# Altium project CoffeeScale.PrjPcb
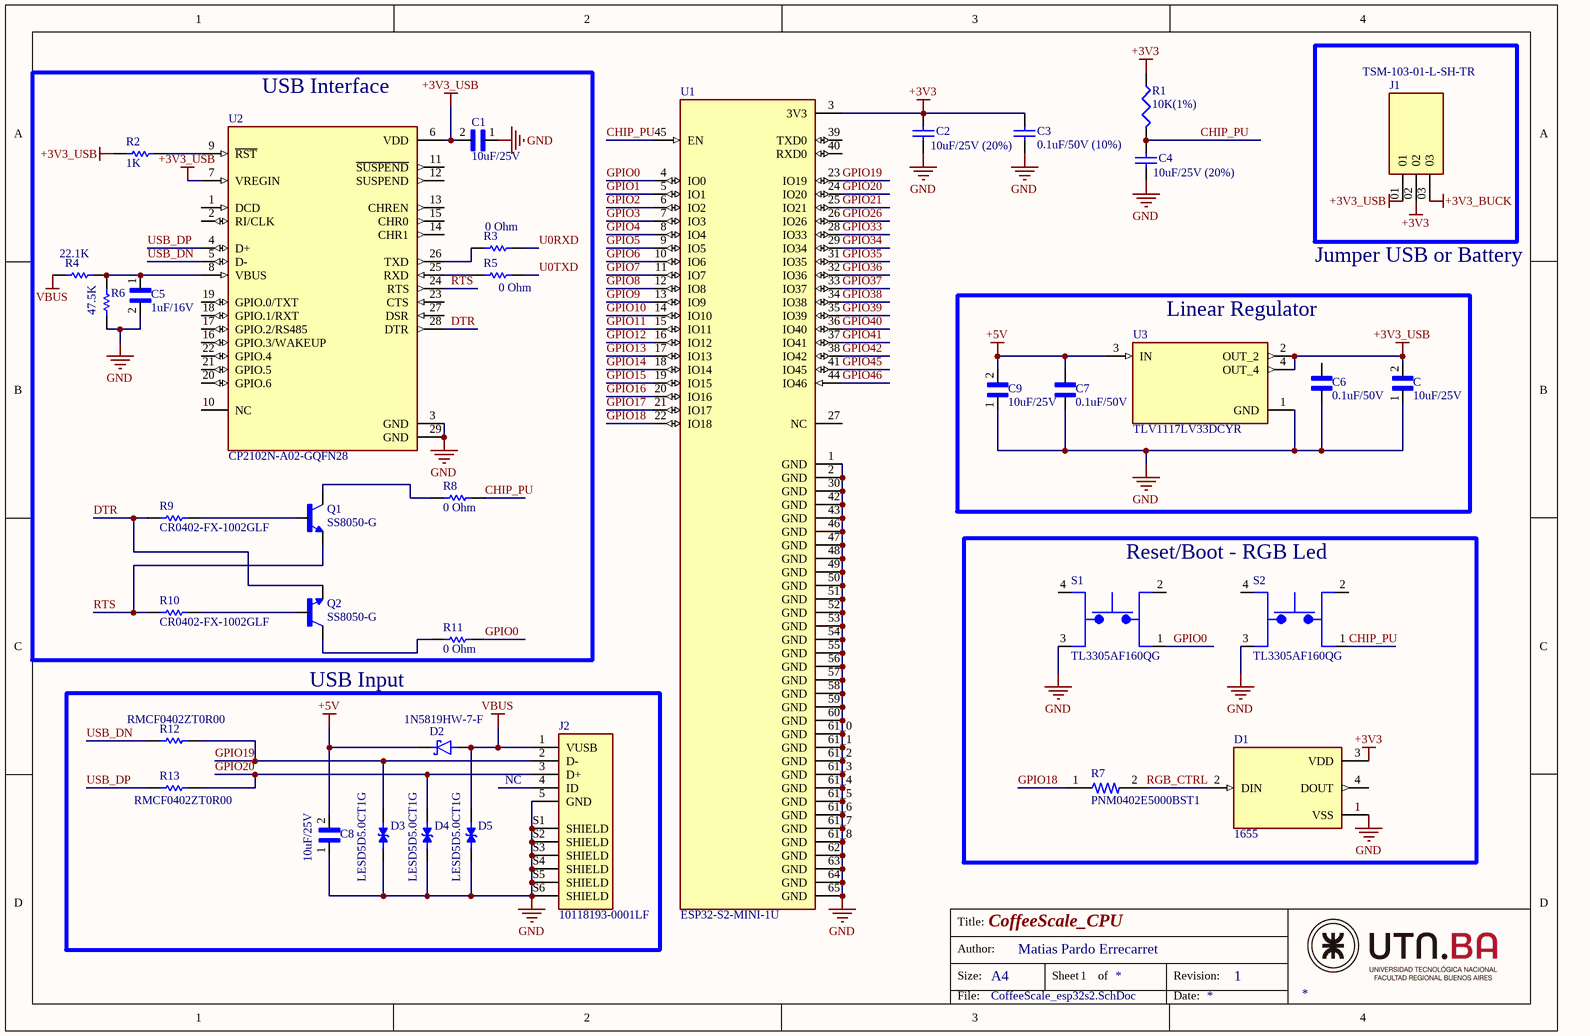
[diagram p0: CoffeeScale_esp32s2.SchDoc]
1 sheet, 37 parts. Net scope: global (net labels, ports and power ports of the same name join across sheets).

## Sheet CoffeeScale_esp32s2.SchDoc: CoffeeScale_CPU
size A4; Author: Matias Pardo Errecarret; Revision: 1; SheetNumber: 1

### Parts
C  10uF/25V  [CAPC2012X140N]
C1  10uF/25V  [CAPC2012X140N]
C2  10uF/25V (20%)  [RAD-0.3]
C3  0.1uF/50V (10%)  [RAD-0.3]
C4  10uF/25V (20%)  [RAD-0.3]
C5  1uF/16V  [CAPC1005X55N]
C6  0.1uF/50V  [CAPC1005X55N]
C7  0.1uF/50V  [CAPC1005X55N]
C8  10uF/25V  [CAPC2012X140N]
C9  10uF/25V  [CAPC2012X140N]
D1  1655  [LED_1655]
D2  1N5819HW-7-F  [SOD3715X145N]
D3  LESD5D5.0CT1G  [TVS_LESD5D5.0CT1G]
D4  LESD5D5.0CT1G  [TVS_LESD5D5.0CT1G]
D5  LESD5D5.0CT1G  [TVS_LESD5D5.0CT1G]
J1  TSM-103-01-L-SH-TR  [SAMTEC_TSM-103-01-L-SH-TR]
J2  10118193-0001LF  [AMPHENOL_10118193-0001LF]
Q1  SS8050-G  [TRANS_SS8050-G]
Q2  SS8050-G  [TRANS_SS8050-G]
R1  10K(1%)  [J1-0603]
R2  1K  [RESC1005X40N]
R3  0 Ohm  [RESC1005X40]
R4  22.1K  [RESC1005X40N]
R5  0 Ohm  [RESC1005X40]
R6  47.5K  [RESC1005X40N]
R7  PNM0402E5000BST1  [RESC1005X40]
R8  0 Ohm  [RESC1005X40]
R9  CR0402-FX-1002GLF  [RESC1005X40N]
R10  CR0402-FX-1002GLF  [RESC1005X40N]
R11  0 Ohm  [RESC1005X40]
R12  RMCF0402ZT0R00  [RESC1005X40]
R13  RMCF0402ZT0R00  [RESC1005X40]
S1  TL3305AF160QG  [SW_TL3305AF160QG]
S2  TL3305AF160QG  [SW_TL3305AF160QG]
U1  ESP32-S2-MINI-1U  [XCVR_ESP32-S2-MINI-1U]
U2  CP2102N-A02-GQFN28  [QFN50P500X500X80-29N]
U3  TLV1117LV33DCYR  [VREG_TLV1117LV33DCYR]

### Blocks framed on the sheet
USB Interface: C1 C5 Q1 Q2 R2-R6 R8-R11 U2
Linear Regulator: C C6 C7 C9 U3
Reset/Boot - RGB Led: D1 R7 S1 S2
USB Input: C8 D2-D5 J2 R12 R13

### Nets
+3V3: C2.2 C3.2 D1.3(VDD) J1.02 R1.1 U1.3(3V3)
+3V3_BUCK: J1.03
+3V3_USB: C.2 C1.2 J1.01 R2.1 U2.6(VDD) U2.7(VREGIN) U3.2(OUT_2) U3.4(OUT_4)
+5V: C7.2 C8.2 C9.2 D2.C(K) U3.3(IN)
GND: C.1 C1.1 C2.1 C3.1 C4.1 C5.2 C6.1 C7.1 C8.1 C9.1 D1.1(VSS) D3.1 D4.1 D5.1 J2.5(GND) J2.S1(SHIELD) J2.S2(SHIELD) J2.S3(SHIELD) J2.S4(SHIELD) J2.S5(SHIELD) J2.S6(SHIELD) R6.1 S1.3 S2.3 U1.1(GND) U1.2(GND) U1.30(GND) U1.42(GND) U1.43(GND) U1.46(GND) U1.47(GND) U1.48(GND) U1.49(GND) U1.50(GND) U1.51(GND) U1.52(GND) U1.53(GND) U1.54(GND) U1.55(GND) U1.56(GND) U1.57(GND) U1.58(GND) U1.59(GND) U1.60(GND) U1.61_0(GND) U1.61_1(GND) U1.61_2(GND) U1.61_3(GND) U1.61_4(GND) U1.61_5(GND) U1.61_6(GND) U1.61_7(GND) U1.61_8(GND) U1.62(GND) U1.63(GND) U1.64(GND) U1.65(GND) U2.3(GND) U2.29(GND) U3.1(GND)
VBUS: D2.A D5.2 J2.1(VUSB) R4.1
CHIP_PU: C4.2 R1.2 R8.2 S2.1 U1.45(EN)
DTR: Q2.2(E) R9.1 U2.28(DTR)
GPIO0: R11.2 S1.1 U1.4(IO0)
GPIO1: U1.5(IO1)
GPIO2: U1.6(IO2)
GPIO3: U1.7(IO3)
GPIO4: U1.8(IO4)
GPIO5: U1.9(IO5)
GPIO6: U1.10(IO6)
GPIO7: U1.11(IO7)
GPIO8: U1.12(IO8)
GPIO9: U1.13(IO9)
GPIO10: U1.14(IO10)
GPIO11: U1.15(IO11)
GPIO12: U1.16(IO12)
GPIO13: U1.17(IO13)
GPIO14: U1.18(IO14)
GPIO15: U1.19(IO15)
GPIO16: U1.20(IO16)
GPIO17: U1.21(IO17)
GPIO18: R7.1 U1.22(IO18)
GPIO19: D3.2 J2.2(D-) R12.2 U1.23(IO19)
GPIO20: D4.2 J2.3(D+) R13.2 U1.24(IO20)
GPIO21: U1.25(IO21)
GPIO26: U1.26(IO26)
GPIO33: U1.28(IO33)
GPIO34: U1.29(IO34)
GPIO35: U1.31(IO35)
GPIO36: U1.32(IO36)
GPIO37: U1.33(IO37)
GPIO38: U1.34(IO38)
GPIO39: U1.35(IO39)
GPIO40: U1.36(IO40)
GPIO41: U1.37(IO41)
GPIO42: U1.38(IO42)
GPIO45: U1.41(IO45)
GPIO46: U1.44(IO46)
RGB_CTRL: D1.2(DIN) R7.2
RTS: Q1.2(E) R10.1 U2.24(RTS)
U0RXD: R3.2
U0TXD: R5.2
USB_DN: R12.1 U2.5(D-)
USB_DP: R13.1 U2.4(D+)
NetC5_1: C5.1 R4.2 R6.2 U2.8(VBUS)
NetQ1_1: Q1.1(B) R9.2
NetQ1_3: Q1.3(C) R8.1
NetQ2_1: Q2.1(B) R10.2
NetQ2_3: Q2.3(C) R11.1
NetR2_2: R2.2 U2.9(~{RST})
NetR3_1: R3.1 U2.26(TXD)
NetR5_1: R5.1 U2.25(RXD)

Not connected (* = marked no-connect by the designer): C6 2; D1 4(DOUT); J2 4(ID); S1 2 4; S2 2 4; U1 27(NC) 39(TXD0) 40(RXD0); U2 1(DCD) 2(RI/CLK) 10(NC) 11(~{SUSPEND}) 12(SUSPEND) 13(CHREN) 14(CHR1) 15(CHR0) 16(GPIO.3/WAKEUP) 17(GPIO.2/RS485) 18(GPIO.1/RXT) 19(GPIO.0/TXT) 20(GPIO.6) 21(GPIO.5) 22(GPIO.4) 23(CTS) 27(DSR)

### Notes on the sheet
- Jumper USB or Battery
- NC
- Title:
- Size:
- Author:
- A4
- Sheet
- of
- Revision:
- File:
- Date:

### Library data of the parts
C C1 C8 C9 = GRM21BR61E106KA73K: SMD Capacitor X5R_EIA_ with Capacitance: 10uF Tol. 10%. Rated Voltage: 25Vdc; MF: Murata; Value: *; Digi-Key_Purchase_URL: https://www.digikey.com/product-detail/en/murata-electronics/GRM21BR61E106KA73K/490-16824-1-ND/7595732?utm_source=snapeda&utm_medium=aggregator&utm_campaign=symbol; MP: GRM21BR61E106KA73K; Package: 2012 Murata; Digi-Key_Part_Number: 490-16824-1-ND; SnapEDA_Link: https://www.snapeda.com/parts/GRM21BR61E106KA73K/Murata/view-part/4375513/?ref=snap
C2-C4 = Cap: Capacitor; Published: 8-Jun-2000; LatestRevisionDate: 17-Jul-2002; LatestRevisionNote: Re-released for DXP Platform.; PackageReference: RAD-0.3; Publisher: Altium Limited; PackageDescription: Radial Cap, Thru-Hole; 2 Leads; 0.3 in Pin Spacing
  C2 C4: Value: 10uF/25V
  C3: Value: 0.1uF/50V
C5 = CL05A105KO5NNNC: 1ÂµF Â±10% 16V Ceramic Capacitor X5R 0402 (1005 Metric); MF: Samsung Electro-Mechanics; Purchase-URL: https://pricing.snapeda.com/search/part/CL05A105KO5NNNC/?ref=eda; SnapEDA_Link: https://www.snapeda.com/parts/CL05A105KO5NNNC/Samsung%20Electro-Mechanics/view-part/3598151/?ref=snap; Availability: Good; Price: None; MP: CL05A105KO5NNNC; Check_prices: https://www.snapeda.com/parts/CL05A105KO5NNNC/Samsung%20Electro-Mechanics/view-part/3598151/?ref=eda; Package: 0402 Samsung; Value: *
C6 C7 = GRM155R71H104KE14D: SMD capacitor X7R(EIA) with capacitance 0.10uF Tol.10%. Rated voltage 50Vdc 125C; MF: Murata Electronics; SnapEDA_Link: https://www.snapeda.com/parts/GRM155R71H104KE14D/Murata+Electronics+North+America/view-part/?ref=snap; Package: 1005 Taiyo Yuden; Value: *; MP: GRM155R71H104KE14D; Check_prices: https://www.snapeda.com/parts/GRM155R71H104KE14D/Murata+Electronics+North+America/view-part/?ref=eda
D1 = 1655: Ws2812b 5050 Rgb Led With Integrated Driver Chip Pack Of 10; Package: None; MP: 1655; Price: None; Availability: Unavailable; Value: *
D2 = 1N5819HW-7-F: Diode Schottky 40 V 1A Surface Mount SOD-123; MF: Diodes Inc.; Value: *; SnapEDA_Link: https://www.snapeda.com/parts/1N5819HW-7-F/Diodes+Inc./view-part/?ref=snap; Purchase-URL: https://pricing.snapeda.com/search/part/1N5819HW-7-F/?ref=eda; Availability: In Stock; Price: None; Package: SOD-123 Fairchild Semiconductor; Check_prices: https://www.snapeda.com/parts/1N5819HW-7-F/Diodes+Inc./view-part/?ref=eda; MP: 1N5819HW-7-F
D3-D5 = LESD5D5.0CT1G: Transient Voltage Suppressors for ESD Protection; MF: Leshan Radio Co.; Check_prices: https://www.snapeda.com/parts/LESD5D5.0CT1G/Leshan+Radio+Co./view-part/?ref=eda; Value: *; Availability: Not in stock; Package: None; SnapEDA_Link: https://www.snapeda.com/parts/LESD5D5.0CT1G/Leshan+Radio+Co./view-part/?ref=snap; MP: LESD5D5.0CT1G; Price: None
J1 = TSM-103-01-L-SH-TR: Connector Header Surface Mount, Right Angle 3 position 0.100 (2.54mm); MF: Samtec Inc.; SnapEDA_Link: https://www.snapeda.com/parts/TSM-103-01-L-SH-TR/Samtec%20Inc./view-part/2800636/?ref=snap; Price: None; Purchase-URL: https://pricing.snapeda.com/search/part/TSM-103-01-L-SH-TR/?ref=eda; Check_prices: https://www.snapeda.com/parts/TSM-103-01-L-SH-TR/Samtec%20Inc./view-part/2800636/?ref=eda; Package: None; Availability: Warning; MP: TSM-103-01-L-SH-TR; Value: *
J2 = 10118193-0001LF: Micro USB 2.0, Input Output Connectors, B TYPE RECEPTACLE; MF: Amphenol ICC; Value: *; MP: 10118193-0001LF; Package: None; Check_prices: https://www.snapeda.com/parts/10118193-0001LF/Amphenol+FCI/view-part/?ref=eda; Purchase-URL: https://pricing.snapeda.com/search/part/10118193-0001LF/?ref=eda; Price: None; Availability: In Stock; SnapEDA_Link: https://www.snapeda.com/parts/10118193-0001LF/Amphenol+FCI/view-part/?ref=snap
Q1 Q2 = SS8050-G: Bipolar (BJT) Transistor NPN 25 V 1.5 A 100MHz 300 mW Surface Mount SOT-23-3; MP: SS8050G; MF: Comchip; Digi-Key_Part_Number: 641-1790-2-ND; Check_prices: https://www.snapeda.com/parts/SS8050G/Comchip/view-part/?ref=eda; Package: None; SnapEDA_Link: https://www.snapeda.com/parts/SS8050G/Comchip/view-part/?ref=snap; Value: *
R1 = Res3: Resistor; Published: 8-Jun-2000; LatestRevisionDate: 29-May-2009; LatestRevisionNote: IPC-7351 Footprint Added.; PackageReference: J1-0603; Publisher: Altium Limited; PackageDescription: Chip Resistor; Value: 10K
R2 = RC0402FR-071KL: 1 kOhms Â±1% 0.063W, 1/16W Chip Resistor 0402 (1005 Metric) Moisture Resistant Thick Film; MF: Yageo; SnapEDA_Link: https://www.snapeda.com/parts/RC0402FR-071KL/Yageo/view-part/?ref=snap; Package: 1005 Panasonic Electronic Components; Value: *; MP: RC0402FR-071KL; Check_prices: https://www.snapeda.com/parts/RC0402FR-071KL/Yageo/view-part/?ref=eda
R3 R5 R8 R11-R13 = RMCF0402ZT0R00: 0 Ohms Jumper 0.063W, 1/16W Chip Resistor 0402 _1005 Metric_ Automotive AEC-Q200 Thick Film; MF: Stackpole Electronics; Value: *; Package: 0402 Stackpole Electronics; MP: RMCF0402ZT0R00; SnapEDA_Link: https://www.snapeda.com/parts/RMCF0402ZT0R00/Stackpole%20Electronics%20Inc/view-part/2772568/?ref=snap; Price: None; Availability: Unavailable
R4 = RC0402FR-0722K1L: THICK FILM RESISTOR, 22.1KOHM 62.5mW 1%; Package: None; Price: None; Value: *; MP: RC0402FR-0722K1L; Availability: Unavailable
R6 = RC0402FR-0747K5L: Res Thick Film 0402 47.5K Ohm 1% 0.063W(1/16W) ??100ppm/??C Epoxy SMD T/R; Package: None; Price: None; Value: *; MP: RC0402FR-0747K5L; Availability: Unavailable
R7 = PNM0402E5000BST1: 500 OHM .1% 25PPM; Package: None; Price: None; Value: *; MP: PNM0402E5000BST1; Availability: Unavailable
R9 R10 = CR0402-FX-1002GLF: Res Thick Film 0402 10K Ohm 1% 1/16W Â±100ppm/Â°C Molded SMD SMD Paper Tape on Plastic Reel; Package: None; Price: None; Value: *; MP: CR0402-FX-1002GLF; Availability: Unavailable
S1 S2 = TL3305AF160QG: Tactile Switch SPST-NO Top Actuated Surface Mount; MF: E-Switch; Package: None; Check_prices: https://www.snapeda.com/parts/TL3305AF160QG/E-Switch/view-part/?ref=eda; Value: *; Purchase-URL: https://pricing.snapeda.com/search/part/TL3305AF160QG/?ref=eda; Availability: In Stock; SnapEDA_Link: https://www.snapeda.com/parts/TL3305AF160QG/E-Switch/view-part/?ref=snap; MP: TL3305AF160QG; Price: None
U1 = ESP32-S2-MINI-1U: WiFi 802.11b/g/n Transceiver Module 2.412GHz ~ 2.484GHz Antenna Not Included Surface Mount; MF: Espressif Systems; MP: ESP32-S2-MINI-1U; Price: None; SnapEDA_Link: https://www.snapeda.com/parts/ESP32-S2-MINI-1U/Espressif+Systems/view-part/?ref=snap; Check_prices: https://www.snapeda.com/parts/ESP32-S2-MINI-1U/Espressif+Systems/view-part/?ref=eda; Availability: In Stock; Value: *; Purchase-URL: https://pricing.snapeda.com/search/part/ESP32-S2-MINI-1U/?ref=eda; Package: VFQFN-56 Espressif Systems
U2 = CP2102N-A02-GQFN28: USB Bridge, USB to UART USB 2.0 UART Interface 28-QFN (5x5); MF: Silicon Labs; Value: *; Price: None; Package: WFQFN-28 Silicon Labs; Check_prices: https://www.snapeda.com/parts/CP2102N-A02-GQFN28/Silicon+Labs/view-part/?ref=eda; Availability: In Stock; SnapEDA_Link: https://www.snapeda.com/parts/CP2102N-A02-GQFN28/Silicon+Labs/view-part/?ref=snap; Purchase-URL: https://pricing.snapeda.com/search/part/CP2102N-A02-GQFN28/?ref=eda; MP: CP2102N-A02-GQFN28
U3 = TLV1117LV33DCYR: 1-A, low-dropout voltage regulator; MF: Texas Instruments; Check_prices: https://www.snapeda.com/parts/TLV1117LV33DCYR/Texas+Instruments/view-part/?ref=eda; Value: *; MP: TLV1117LV33DCYR; Purchase-URL: https://pricing.snapeda.com/search/part/TLV1117LV33DCYR/?ref=eda; SnapEDA_Link: https://www.snapeda.com/parts/TLV1117LV33DCYR/Texas+Instruments/view-part/?ref=snap; Package: SOT-223-4 Texas Instruments; Digi-Key_Part_Number: 296-28778-2-ND